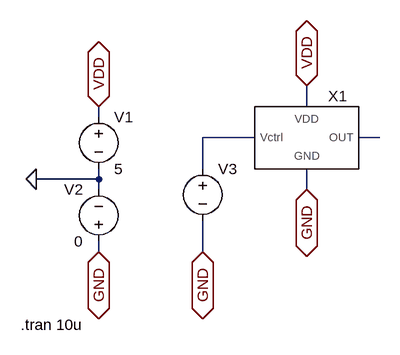
[diagram p0: schematic vcoTB.asc]
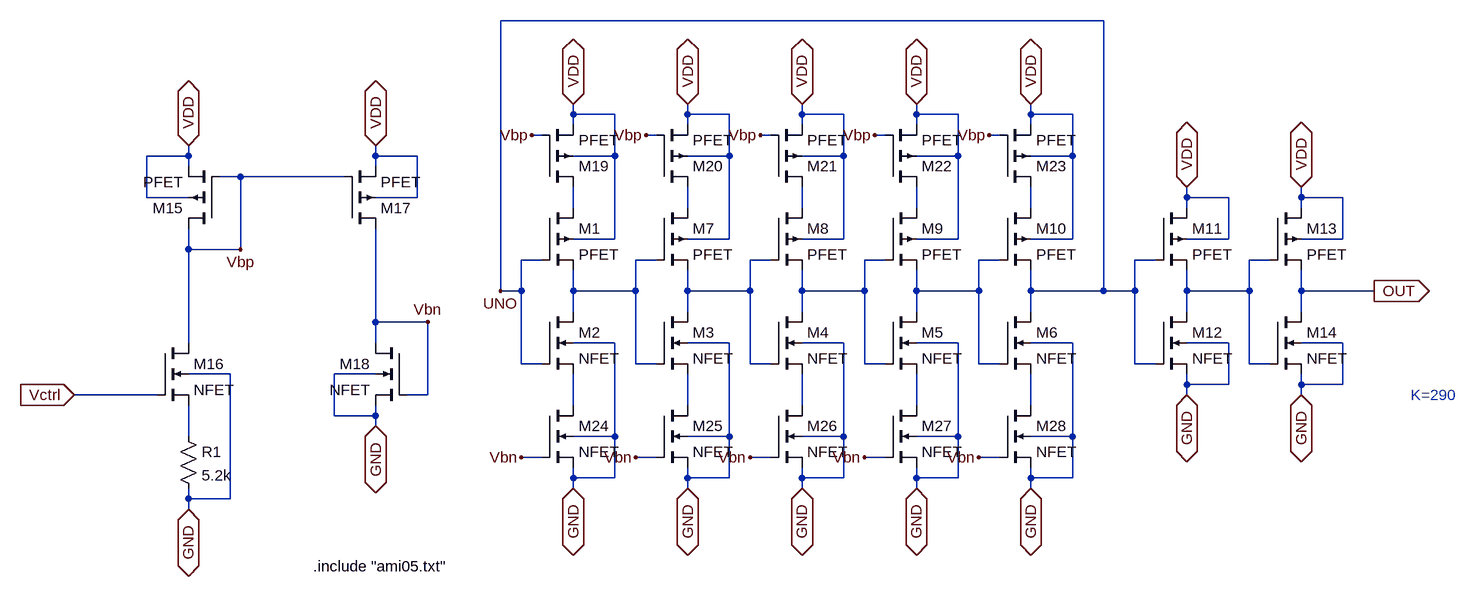
[diagram p1: sub-circuit vco.asc]
vcoTB.asc, the LTspice schematic file:
Version 4
SHEET 1 880 680
WIRE 176 96 176 64
WIRE -144 112 -144 96
WIRE 96 144 16 144
WIRE 288 144 256 144
WIRE 16 192 16 144
WIRE -144 208 -144 192
WIRE -144 208 -240 208
WIRE -144 224 -144 208
WIRE 176 224 176 192
WIRE -144 320 -144 304
WIRE 16 320 16 272
FLAG -144 320 GND
IOPIN -144 320 BiDir
FLAG -144 96 VDD
IOPIN -144 96 BiDir
FLAG -240 208 0
FLAG 16 320 GND
IOPIN 16 320 BiDir
FLAG 176 64 VDD
IOPIN 176 64 BiDir
FLAG 176 224 GND
IOPIN 176 224 BiDir
SYMBOL vco 176 144 R0
SYMATTR InstName X1
SYMBOL voltage -144 96 R0
WINDOW 123 0 0 Left 0
WINDOW 39 0 0 Left 0
SYMATTR InstName V1
SYMATTR Value 5
SYMBOL voltage -144 320 R180
WINDOW 0 24 96 Left 2
WINDOW 3 24 16 Left 2
WINDOW 123 0 0 Left 0
WINDOW 39 0 0 Left 0
SYMATTR InstName V2
SYMATTR Value 0
SYMBOL voltage 16 176 R0
WINDOW 3 24 96 Invisible 2
WINDOW 123 0 0 Left 0
WINDOW 39 0 0 Left 0
SYMATTR InstName V3
SYMATTR Value PULSE(0 5 0 10u 1o 1p)
TEXT -264 432 Left 2 !.tran 10u

vco.asc, the sub-circuit schematic file:
Version 4
SHEET 1 1320 768
WIRE 768 -240 -160 -240
WIRE -48 -96 -48 -112
WIRE 16 -96 -48 -96
WIRE 128 -96 128 -112
WIRE 192 -96 128 -96
WIRE 304 -96 304 -112
WIRE 368 -96 304 -96
WIRE 480 -96 480 -112
WIRE 544 -96 480 -96
WIRE 656 -96 656 -112
WIRE 720 -96 656 -96
WIRE -48 -80 -48 -96
WIRE 128 -80 128 -96
WIRE 304 -80 304 -96
WIRE 480 -80 480 -96
WIRE 656 -80 656 -96
WIRE -96 -64 -112 -64
WIRE 80 -64 64 -64
WIRE 256 -64 240 -64
WIRE 432 -64 416 -64
WIRE 608 -64 592 -64
WIRE -640 -32 -640 -48
WIRE -640 -32 -704 -32
WIRE -352 -32 -352 -48
WIRE -288 -32 -352 -32
WIRE 16 -32 16 -96
WIRE 16 -32 -48 -32
WIRE 192 -32 192 -96
WIRE 192 -32 128 -32
WIRE 368 -32 368 -96
WIRE 368 -32 304 -32
WIRE 544 -32 544 -96
WIRE 544 -32 480 -32
WIRE 720 -32 720 -96
WIRE 720 -32 656 -32
WIRE -640 -16 -640 -32
WIRE -352 -16 -352 -32
WIRE -560 0 -592 0
WIRE -400 0 -560 0
WIRE -704 32 -704 -32
WIRE -640 32 -704 32
WIRE -288 32 -288 -32
WIRE -288 32 -352 32
WIRE 896 32 896 16
WIRE 960 32 896 32
WIRE 1072 32 1072 16
WIRE 1136 32 1072 32
WIRE -48 48 -48 16
WIRE 128 48 128 16
WIRE 304 48 304 16
WIRE 480 48 480 16
WIRE 656 48 656 16
WIRE 896 48 896 32
WIRE 1072 48 1072 32
WIRE 16 96 16 -32
WIRE 16 96 -48 96
WIRE 192 96 192 -32
WIRE 192 96 128 96
WIRE 368 96 368 -32
WIRE 368 96 304 96
WIRE 544 96 544 -32
WIRE 544 96 480 96
WIRE 720 96 720 -32
WIRE 720 96 656 96
WIRE 960 96 960 32
WIRE 960 96 896 96
WIRE 1136 96 1136 32
WIRE 1136 96 1072 96
WIRE -640 112 -640 80
WIRE -560 112 -560 0
WIRE -560 112 -640 112
WIRE -96 128 -128 128
WIRE 80 128 48 128
WIRE 256 128 224 128
WIRE 432 128 400 128
WIRE 608 128 576 128
WIRE 848 128 816 128
WIRE 1024 128 992 128
WIRE -160 176 -160 -240
WIRE -128 176 -128 128
WIRE -128 176 -160 176
WIRE -48 176 -48 144
WIRE 48 176 48 128
WIRE 48 176 -48 176
WIRE 128 176 128 144
WIRE 224 176 224 128
WIRE 224 176 128 176
WIRE 304 176 304 144
WIRE 400 176 400 128
WIRE 400 176 304 176
WIRE 480 176 480 144
WIRE 576 176 576 128
WIRE 576 176 480 176
WIRE 656 176 656 144
WIRE 768 176 768 -240
WIRE 768 176 656 176
WIRE 816 176 816 128
WIRE 816 176 768 176
WIRE 896 176 896 144
WIRE 992 176 992 128
WIRE 992 176 896 176
WIRE 1072 176 1072 144
WIRE 1184 176 1072 176
WIRE -48 208 -48 176
WIRE 128 208 128 176
WIRE 304 208 304 176
WIRE 480 208 480 176
WIRE 656 208 656 176
WIRE 896 208 896 176
WIRE 1072 208 1072 176
WIRE -352 224 -352 80
WIRE -272 224 -352 224
WIRE -640 256 -640 112
WIRE -352 256 -352 224
WIRE 16 256 -48 256
WIRE 192 256 128 256
WIRE 368 256 304 256
WIRE 544 256 480 256
WIRE 720 256 656 256
WIRE 960 256 896 256
WIRE 1136 256 1072 256
WIRE -128 288 -128 176
WIRE -96 288 -128 288
WIRE 48 288 48 176
WIRE 80 288 48 288
WIRE 224 288 224 176
WIRE 256 288 224 288
WIRE 400 288 400 176
WIRE 432 288 400 288
WIRE 576 288 576 176
WIRE 608 288 576 288
WIRE 816 288 816 176
WIRE 848 288 816 288
WIRE 992 288 992 176
WIRE 1024 288 992 288
WIRE -576 304 -640 304
WIRE -352 304 -416 304
WIRE 896 320 896 304
WIRE 960 320 960 256
WIRE 960 320 896 320
WIRE 1072 320 1072 304
WIRE 1136 320 1136 256
WIRE 1136 320 1072 320
WIRE -688 336 -816 336
WIRE -272 336 -272 224
WIRE -272 336 -304 336
WIRE 896 336 896 320
WIRE 1072 336 1072 320
WIRE -48 352 -48 304
WIRE 128 352 128 304
WIRE 304 352 304 304
WIRE 480 352 480 304
WIRE 656 352 656 304
WIRE -416 368 -416 304
WIRE -352 368 -352 352
WIRE -352 368 -416 368
WIRE -352 384 -352 368
WIRE -640 400 -640 352
WIRE 16 400 16 256
WIRE 16 400 -48 400
WIRE 192 400 192 256
WIRE 192 400 128 400
WIRE 368 400 368 256
WIRE 368 400 304 400
WIRE 544 400 544 256
WIRE 544 400 480 400
WIRE 720 400 720 256
WIRE 720 400 656 400
WIRE -96 432 -128 432
WIRE 80 432 48 432
WIRE 256 432 224 432
WIRE 432 432 400 432
WIRE 608 432 576 432
WIRE -48 464 -48 448
WIRE 16 464 16 400
WIRE 16 464 -48 464
WIRE 128 464 128 448
WIRE 192 464 192 400
WIRE 192 464 128 464
WIRE 304 464 304 448
WIRE 368 464 368 400
WIRE 368 464 304 464
WIRE 480 464 480 448
WIRE 544 464 544 400
WIRE 544 464 480 464
WIRE 656 464 656 448
WIRE 720 464 720 400
WIRE 720 464 656 464
WIRE -48 480 -48 464
WIRE 128 480 128 464
WIRE 304 480 304 464
WIRE 480 480 480 464
WIRE 656 480 656 464
WIRE -640 496 -640 480
WIRE -576 496 -576 304
WIRE -576 496 -640 496
WIRE -640 512 -640 496
FLAG 896 16 VDD
IOPIN 896 16 BiDir
FLAG 896 336 GND
IOPIN 896 336 BiDir
FLAG 1072 16 VDD
IOPIN 1072 16 BiDir
FLAG 1072 336 GND
IOPIN 1072 336 BiDir
FLAG -160 176 UNO
FLAG -640 -48 VDD
IOPIN -640 -48 BiDir
FLAG -352 -48 VDD
IOPIN -352 -48 BiDir
FLAG -640 512 GND
IOPIN -640 512 BiDir
FLAG -352 384 GND
IOPIN -352 384 BiDir
FLAG -48 -112 VDD
IOPIN -48 -112 BiDir
FLAG -112 -64 Vbp
FLAG 128 -112 VDD
IOPIN 128 -112 BiDir
FLAG 64 -64 Vbp
FLAG 304 -112 VDD
IOPIN 304 -112 BiDir
FLAG 240 -64 Vbp
FLAG 480 -112 VDD
IOPIN 480 -112 BiDir
FLAG 416 -64 Vbp
FLAG 656 -112 VDD
IOPIN 656 -112 BiDir
FLAG 592 -64 Vbp
FLAG -560 112 Vbp
FLAG -272 224 Vbn
FLAG -48 480 GND
IOPIN -48 480 BiDir
FLAG -128 432 Vbn
FLAG 128 480 GND
IOPIN 128 480 BiDir
FLAG 48 432 Vbn
FLAG 304 480 GND
IOPIN 304 480 BiDir
FLAG 224 432 Vbn
FLAG 480 480 GND
IOPIN 480 480 BiDir
FLAG 400 432 Vbn
FLAG 656 480 GND
IOPIN 656 480 BiDir
FLAG 576 432 Vbn
FLAG -816 336 Vctrl
IOPIN -816 336 In
FLAG 1184 176 OUT
IOPIN 1184 176 Out
SYMBOL pmos4 -96 48 R0
SYMATTR InstName M1
SYMATTR Value2 l=0.9u w=3u
SYMATTR Value PFET
SYMBOL nmos4 -96 208 R0
SYMATTR InstName M2
SYMATTR Value2 l=0.9u w=1.5u
SYMATTR Value NFET
SYMBOL pmos4 848 48 R0
SYMATTR InstName M11
SYMATTR Value2 l=0.6u w=3u
SYMATTR Value PFET
SYMBOL nmos4 848 208 R0
SYMATTR InstName M12
SYMATTR Value2 l=0.6u w=1.5u
SYMATTR Value NFET
SYMBOL pmos4 1024 48 R0
SYMATTR InstName M13
SYMATTR Value2 l=0.6u w=3u
SYMATTR Value PFET
SYMBOL nmos4 1024 208 R0
SYMATTR InstName M14
SYMATTR Value2 l=0.6u w=1.5u
SYMATTR Value NFET
SYMBOL pmos4 -592 80 R180
SYMATTR InstName M15
SYMATTR Value2 l=0.9u w=6.3u
SYMATTR Value PFET
SYMBOL nmos4 -688 256 R0
SYMATTR InstName M16
SYMATTR Value2 l=0.6u w=5.1u
SYMATTR Value NFET
SYMBOL pmos4 -400 80 M180
SYMATTR InstName M17
SYMATTR Value2 l=0.9u w=6.3u
SYMATTR Value PFET
SYMBOL nmos4 -304 256 M0
SYMATTR InstName M18
SYMATTR Value2 l=0.9u w=2.1u
SYMATTR Value NFET
SYMBOL res -656 384 R0
SYMATTR InstName R1
SYMATTR Value 5.2k
SYMBOL pmos4 -96 16 M180
SYMATTR InstName M19
SYMATTR Value2 l=0.9u w=6.3u
SYMATTR Value PFET
SYMBOL pmos4 80 16 M180
SYMATTR InstName M20
SYMATTR Value2 l=0.9u w=6.3u
SYMATTR Value PFET
SYMBOL pmos4 256 16 M180
SYMATTR InstName M21
SYMATTR Value2 l=0.9u w=6.3u
SYMATTR Value PFET
SYMBOL pmos4 432 16 M180
SYMATTR InstName M22
SYMATTR Value2 l=0.9u w=6.3u
SYMATTR Value PFET
SYMBOL pmos4 608 16 M180
SYMATTR InstName M23
SYMATTR Value2 l=0.9u w=6.3u
SYMATTR Value PFET
SYMBOL nmos4 -96 352 R0
SYMATTR InstName M24
SYMATTR Value2 l=0.9u w=2.1u
SYMATTR Value NFET
SYMBOL nmos4 80 352 R0
SYMATTR InstName M25
SYMATTR Value2 l=0.9u w=2.1u
SYMATTR Value NFET
SYMBOL nmos4 256 352 R0
SYMATTR InstName M26
SYMATTR Value2 l=0.9u w=2.1u
SYMATTR Value NFET
SYMBOL nmos4 432 352 R0
SYMATTR InstName M27
SYMATTR Value2 l=0.9u w=2.1u
SYMATTR Value NFET
SYMBOL nmos4 608 352 R0
SYMATTR InstName M28
SYMATTR Value2 l=0.9u w=2.1u
SYMATTR Value NFET
SYMBOL pmos4 80 48 R0
SYMATTR InstName M7
SYMATTR Value2 l=0.9u w=3u
SYMATTR Value PFET
SYMBOL pmos4 256 48 R0
SYMATTR InstName M8
SYMATTR Value2 l=0.9u w=3u
SYMATTR Value PFET
SYMBOL pmos4 432 48 R0
SYMATTR InstName M9
SYMATTR Value2 l=0.9u w=3u
SYMATTR Value PFET
SYMBOL pmos4 608 48 R0
SYMATTR InstName M10
SYMATTR Value2 l=0.9u w=3u
SYMATTR Value PFET
SYMBOL nmos4 80 208 R0
SYMATTR InstName M3
SYMATTR Value2 l=0.9u w=1.5u
SYMATTR Value NFET
SYMBOL nmos4 256 208 R0
SYMATTR InstName M4
SYMATTR Value2 l=0.9u w=1.5u
SYMATTR Value NFET
SYMBOL nmos4 432 208 R0
SYMATTR InstName M5
SYMATTR Value2 l=0.9u w=1.5u
SYMATTR Value NFET
SYMBOL nmos4 608 208 R0
SYMATTR InstName M6
SYMATTR Value2 l=0.9u w=1.5u
SYMATTR Value NFET
TEXT -448 600 Left 2 !.include "ami05.txt"
TEXT 1240 336 Left 2 ;K=290

The netlist it stands for:
* vcoTB.asc
XX1 N001 GND N002 VDD vco
V1 VDD 0 5
V2 GND 0 0
V3 N001 GND PULSE(0 5 0 10u 1o 1p)

* block symbol definitions
.subckt vco Vctrl GND OUT VDD
M1 N001 UNO N006 VDD PFET l=0.9u w=3u
M2 N006 UNO N011 GND NFET l=0.9u w=1.5u
M11 VDD UNO N010 VDD PFET l=0.6u w=3u
M12 N010 UNO GND GND NFET l=0.6u w=1.5u
M13 VDD N010 OUT VDD PFET l=0.6u w=3u
M14 OUT N010 GND GND NFET l=0.6u w=1.5u
M15 Vbp Vbp VDD VDD PFET l=0.9u w=6.3u
M16 Vbp Vctrl N016 GND NFET l=0.6u w=5.1u
M17 Vbn Vbp VDD VDD PFET l=0.9u w=6.3u
M18 Vbn Vbn GND GND NFET l=0.9u w=2.1u
R1 N016 GND 5.2k
M19 N001 Vbp VDD VDD PFET l=0.9u w=6.3u
M20 N002 Vbp VDD VDD PFET l=0.9u w=6.3u
M21 N003 Vbp VDD VDD PFET l=0.9u w=6.3u
M22 N004 Vbp VDD VDD PFET l=0.9u w=6.3u
M23 N005 Vbp VDD VDD PFET l=0.9u w=6.3u
M24 N011 Vbn GND GND NFET l=0.9u w=2.1u
M25 N012 Vbn GND GND NFET l=0.9u w=2.1u
M26 N013 Vbn GND GND NFET l=0.9u w=2.1u
M27 N014 Vbn GND GND NFET l=0.9u w=2.1u
M28 N015 Vbn GND GND NFET l=0.9u w=2.1u
M7 N002 N006 N007 VDD PFET l=0.9u w=3u
M8 N003 N007 N008 VDD PFET l=0.9u w=3u
M9 N004 N008 N009 VDD PFET l=0.9u w=3u
M10 N005 N009 UNO VDD PFET l=0.9u w=3u
M3 N007 N006 N012 GND NFET l=0.9u w=1.5u
M4 N008 N007 N013 GND NFET l=0.9u w=1.5u
M5 N009 N008 N014 GND NFET l=0.9u w=1.5u
M6 UNO N009 N015 GND NFET l=0.9u w=1.5u
.include "ami05.txt"
* K=290
.ends vco

.model NMOS NMOS
.model PMOS PMOS
.lib standard.mos
.tran 10u
.backanno
.end